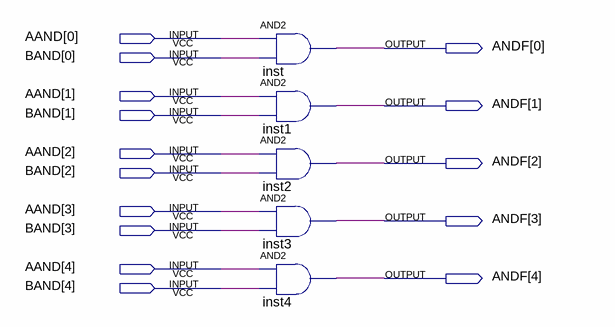
[diagram p0: schematic sheet]
// Quartus schematic AANDB.bdf as structural Verilog: 5 symbols, 15 pins
module AANDB (
  input  [4:0] AAND,
  input  [4:0] BAND,
  output [4:0] ANDF
);

  and inst (ANDF[0], AAND[0], BAND[0]);
  and inst1 (ANDF[1], AAND[1], BAND[1]);
  and inst2 (ANDF[2], AAND[2], BAND[2]);
  and inst3 (ANDF[3], AAND[3], BAND[3]);
  and inst4 (ANDF[4], AAND[4], BAND[4]);
endmodule
